# EAGLE design CHEAPO4 (EAGLE 6.3)
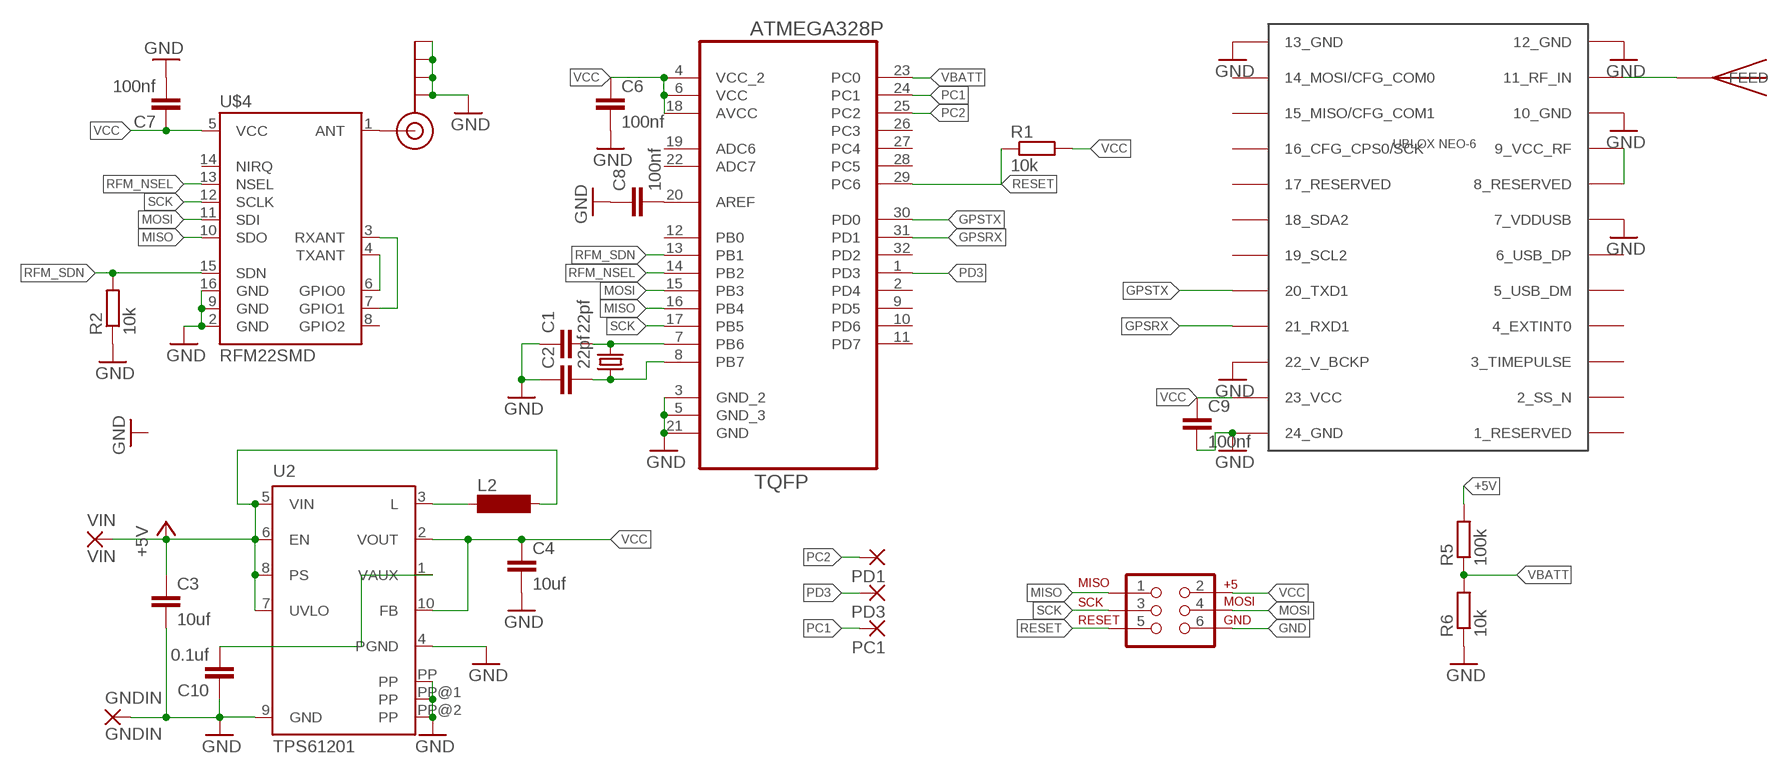
[diagram p0: schematic, sheet 1]

## Parts
C1  22pf  C-EUC0603  [C0603]
C2  22pf  C-EUC0603  [C0603]
C3  10uf  C-EUC1206  [C1206]
C4  10uf  C-EUC1206  [C1206]
C6  100nf  C-EUC0603  [C0603]
C7  100nf  C-EUC0603  [C0603]
C8  100nf  C-EUC0603  [C0603]
C9  100nf  C-EUC0603  [C0603]
C10  0.1uf  C-EUC0603  [C0603]
GNDIN  GNDIN  SMD2  [SMD1,27-2,54]
J1  AVR_SPI_PRG_6PTH  [2X3]
J$1  SMA_EDGE  [SMA-EDGE]
L2  MS50  [MS50]
PC1  SMD2  [SMD1,27-2,54]
PD1  SMD2  [SMD1,27-2,54]
PD3  SMD2  [SMD1,27-2,54]
R1  10k  R-EU_R0603  [R0603]
R2  10k  R-EU_R0603  [R0603]
R5  100k  R-EU_R0603  [R0603]
R6  10k  R-EU_R0603  [R0603]
U1  ATMEGA328P-AU  [QFP80P900X900X120-32N]
U2  TPS61201  [S-PDSO-N10]
U$1  UBLOX_NEO-6  [UBLOX_NEO-6P]
U$2  ABRACON_ABM3_CRYSTALABM03_HC49  [ABM03_HC49]
U$3  JTI_ANTENNA-1575AT43A40  [JTI_ANTENNA-1575AT43A40]
U$4  RFM22SMD  [RFM22-XXX-S2]
VIN  VIN  SMD2  [SMD1,27-2,54]

## Nets
+5V: C3.1 L2.2 R5.2 U2.5(VIN) U2.6(EN) U2.7(UVLO) U2.8(PS) VIN.1(P)
GND: C1.1 C2.1 C3.2 C4.2 C6.2 C7.2 C8.1 C9.2 C10.1 GNDIN.1(P) J1.6 J$1.GND@0(GND) J$1.GND@1(GND) J$1.GND@2(GND) J$1.GND@3(GND) R2.1 R6.1 U1.3(GND_2) U1.5(GND_3) U1.21(GND) U2.4(PGND) U2.9(GND) U2.PP U2.PP@1(PP) U2.PP@2(PP) U$1.7_VDDUSB U$1.10_GND U$1.12_GND U$1.13_GND U$1.22_V_BCKP U$1.24_GND U$4.2(GND) U$4.9(GND) U$4.16(GND)
GPSRX: U1.31(PD1) U$1.21_RXD1
GPSTX: U1.30(PD0) U$1.20_TXD1
MISO: J1.1 U1.16(PB4) U$4.10(SDO)
MOSI: J1.4 U1.15(PB3) U$4.11(SDI)
N$1: C1.2 U1.7(PB6) U$2.2
N$2: C2.2 U1.8(PB7) U$2.1
N$3: U$4.4(TXANT) U$4.6(GPIO0)
N$4: U$4.3(RXANT) U$4.7(GPIO1)
N$5: U$1.8_RESERVED U$1.9_VCC_RF
N$6: U$1.11_RF_IN U$3.FEED
N$7: C8.2 U1.20(AREF)
N$8: J$1.SIG(SIGNAL) U$4.1(ANT)
N$11: L2.1 U2.3(L)
N$13: C10.2 U2.1(VAUX)
PC1: PC1.1(P) U1.24(PC1)
PC2: PD1.1(P) U1.25(PC2)
PD3: PD3.1(P) U1.1(PD3)
RESET: J1.5 R1.1 U1.29(PC6)
RFM_NSEL: U1.14(PB2) U$4.13(NSEL)
RFM_SDN: R2.2 U1.13(PB1) U$4.15(SDN)
SCK: J1.3 U1.17(PB5) U$4.12(SCLK)
VBATT: R5.1 R6.2 U1.23(PC0)
VCC: C4.1 C6.1 C7.1 C9.1 J1.2 R1.2 U1.4(VCC_2) U1.6(VCC) U1.18(AVCC) U2.2(VOUT) U2.10(FB) U$1.23_VCC U$4.5(VCC)
Unconnected: U1.2(PD4) U1.9(PD5) U1.10(PD6) U1.11(PD7) U1.12(PB0) U1.19(ADC6) U1.22(ADC7) U1.26(PC3) U1.27(PC4) U1.28(PC5) U1.32(PD2) U$1.1_RESERVED U$1.2_SS_N U$1.3_TIMEPULSE U$1.4_EXTINT0 U$1.5_USB_DM U$1.6_USB_DP U$1.14_MOSI/CFG_COM0 U$1.15_MISO/CFG_COM1 U$1.16_CFG_CPS0/SCK U$1.17_RESERVED U$1.18_SDA2 U$1.19_SCL2 U$4.8(GPIO2) U$4.14(NIRQ)

## Library data of the parts
C1-C4 C6-C10 = rcl:C-EU: CAPACITOR, European symbol
GNDIN PC1 PD1 PD3 VIN = wirepad:SMD2: SMD PAD
J1 = SparkFun-Connectors:AVR_SPI_PRG_6: AVR ISP 6 Pin This is the reduced ISP connector for AVR programming. Common on Arduino. This footprint will take up less PCB space and can be used with a 10-pin to 6-pin adapter such as SKU: BOB-08508
J$1 = SparkFun-Connectors:SMA_EDGE: SMA Antenna Connector End launch SMA connector. The paste layer has been removed so that the connector can be hand soldered onto the board after reflow.
L2 = inductor-neosid:MS50: INDUCTOR SMD power inductor; OC_FARNELL: unknown; OC_NEWARK: unknown
R1 R2 R5 R6 = rcl:R-EU_: RESISTOR, European symbol
U1 = Ava:ATMEGA328P-AU; DESCRIPTION: 8-bit Microcontroller with In-System Programmable Flash; MPN: ATMEGA328P-AU; OC_FARNELL: 1715486; OC_NEWARK: 14R4631; PACKAGE: TQFP-32; SUPPLIER: Atmel
U2 = texas:TPS6120*: LOW INPUT VOLTAGE SYNCHRONOUS BOOST CONVERTER WITH 1.3-A SWITCHES Source: http://focus.ti.com/lit/ds/symlink/tps61200.pdf; MPN: TPS61200DRCT; OC_FARNELL: 1471238; OC_NEWARK: 37M0066
U$1 = Ava:UBLOX_NEO-6: UBLOX NEO-6 GPS MODULE Author Anthony Stirk / http://ava.upuaut.net http://www.u-blox.com/images/downloads/Product_Docs/LEA-6_NEO-6_MAX-6_HardwareIntegrationManual_%28GPS.G6-HW-09007%29.pdf http://www.u-blox.com/images/downloads/Product_Docs/NEO-6_DataSheet_%28GPS.G6-HW-09005%29.pdf
U$2 = Ava:ABRACON_ABM3_CRYSTAL
U$3 = Ava:JTI_ANTENNA-1575AT43A40
U$4 = SparkFun-RF:RFM22: The RFM22 is a low-power, low cost radio that is capable of operating in the 434MHz and 900MHz open bands. It's frequency is software defined and there are some very good libraries written for it.

## Board
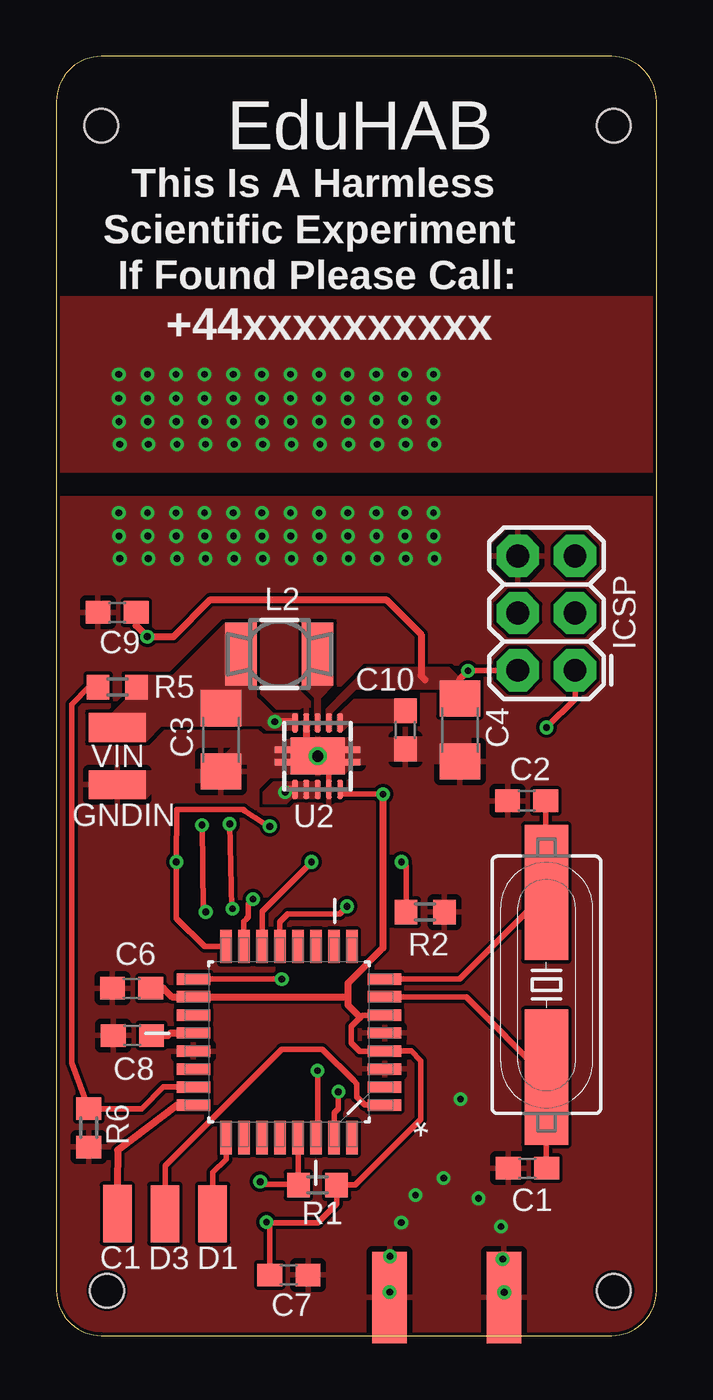
[diagram p1: board, top side]
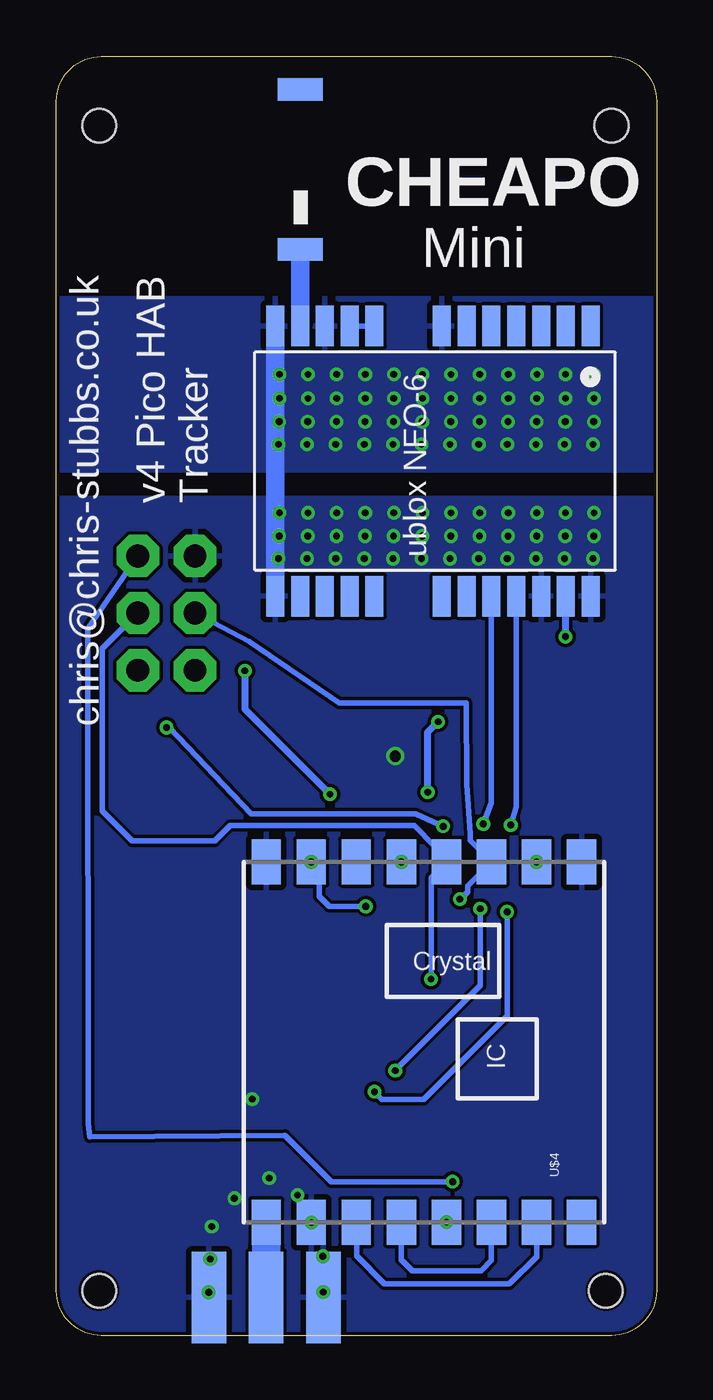
[diagram p2: board, bottom side, seen from below]

Size 26.65 x 56.82 mm. Coordinates in mm from the lower left corner, seen from the top.
Outline: 26.65,2 26.65,54.82 arc90 24.65,56.82 2,56.82 arc90 0,54.82 0,2 arc90 2,0 24.65,0 arc90 26.65,2
Copper layers (1*16): Top 0.035mm / dielectric 1.5mm / Bottom 0.035mm
Design rules "Hackvana": minimum track width 6mil, minimum drill 0.3mm, track to track 6mil, track to pad 6mil, pad to pad 6mil, via to via 6mil, smd to smd 0mil, copper to edge 6mil, drill to drill 6mil, minimum pad ring 10mil, minimum via ring 6mil, stop-mask expansion 2mil, vias tented up to drill 100mil, thermal gap 10mil
Holes 1.5 mm at 2,53.73 24.75,53.73 2.25,2 24.75,2

### Footprints (pad centres in the part's own frame; a part is rotated, then mirrored left to right if it is on the bottom)
C0603 = smd 1.1 x 1: 1 -0.85,0; 2 0.85,0
C1206 = smd 1.6 x 1.8: 1 -1.4,0; 2 1.4,0
SMD1,27-2,54 = smd 1.27 x 2.54: 1 0,0
2X3 = drill 1.016 pad 1.88 octagon: 1 0,0; 2 0,2.54; 3 2.54,0; 4 2.54,2.54; 5 5.08,0; 6 5.08,2.54
SMA-EDGE = smd 1.524 x 4.064: GND@0 0,0; GND@1 5.08,0; SIG 2.54,0 | smd 1.524 x 4.064 bottom: GND@2 0,0; GND@3 5.08,0
MS50 = smd 2.8 x 1.4: 1 0,-1.7; 2 0,1.7
R0603 = smd 1 x 1.1: 1 -0.85,0; 2 0.85,0
QFP80P900X900X120-32N = smd 1.473 x 0.508: 1 -4.242,2.794; 2 -4.242,2.007; 3 -4.242,1.194; 4 -4.242,0.406; 5 -4.242,-0.406; 6 -4.242,-1.194; 7 -4.242,-2.007; 8 -4.242,-2.794; 17 4.242,-2.794; 18 4.242,-2.007; 19 4.242,-1.194; 20 4.242,-0.406; 21 4.242,0.406; 22 4.242,1.194; 23 4.242,2.007; 24 4.242,2.794 | smd 0.508 x 1.473: 9 -2.794,-4.242; 10 -2.007,-4.242; 11 -1.194,-4.242; 12 -0.406,-4.242; 13 0.406,-4.242; 14 1.194,-4.242; 15 2.007,-4.242; 16 2.794,-4.242; 25 2.794,4.242; 26 2.007,4.242; 27 1.194,4.242; 28 0.406,4.242; 29 -0.406,4.242; 30 -1.194,4.242; 31 -2.007,4.242; 32 -2.794,4.242
S-PDSO-N10 = smd 0.28 x 0.85: 1 -1,-1.475; 2 -0.5,-1.475; 3 0,-1.475; 4 0.5,-1.475; 5 1,-1.475; 6 1,1.475; 7 0.5,1.475; 8 0,1.475; 9 -0.5,1.475; 10 -1,1.475 | smd 2.4 x 1.65: PP 0,0 | smd 3.8 x 0.28: PP@1 0,0.275; PP@2 0,-0.275
UBLOX_NEO-6P = smd 1.8 x 0.8: 1_RESERVED 6.4,-7.4; 2_SS_N 6.4,-6.3; 3_TIMEPULSE 6.4,-5.2; 4_EXTINT0 6.4,-4.1; 5_USB_DM 6.4,-3; 6_USB_DP 6.4,-1.9; 7_VDDUSB 6.4,-0.8; 8_RESERVED 6.4,2.2; 9_VCC_RF 6.4,3.3; 10_GND 6.4,4.4; 11_RF_IN 6.4,5.5; 12_GND 6.4,6.6; 13_GND -5.6,6.6; 14_MOSI/CFG_COM0 -5.6,5.5; 15_MISO/CFG_COM1 -5.6,4.4; 16_CFG_CPS0/SCK -5.6,3.3; 17_RESERVED -5.6,2.2; 18_SDA2 -5.6,-0.8; 19_SCL2 -5.6,-1.9; 20_TXD1 -5.6,-3; 21_RXD1 -5.6,-4.1; 22_V_BCKP -5.6,-5.2; 23_VCC -5.6,-6.3; 24_GND -5.6,-7.4
ABM03_HC49 = smd 6 x 1.93: 1 -4.1,0; 2 4.1,0
JTI_ANTENNA-1575AT43A40 = smd 1 x 2: FEED -3.175,0; NC 3.925,0
RFM22-XXX-S2 = smd 2 x 1.3: 1 -8,7; 2 -8,5; 3 -8,3; 4 -8,1; 5 -8,-1; 6 -8,-3; 7 -8,-5; 8 -8,-7; 9 8,-7; 10 8,-5; 11 8,-3; 12 8,-1; 13 8,1; 14 8,3; 15 8,5; 16 8,7

### Placement (x,y rotation side)
C1  20.92,7.43 0 top
C2  20.88,23.75 0 top
C3  7.31,26.46 270 top
C4  17.92,26.9 270 top
C6  3.34,15.42 180 top
C7  10.33,2.69 0 top
C8  3.38,13.33 0 top
C9  2.7,32.12 180 top
C10  15.5,26.9 90 top
GNDIN  2.71,24.47 270 top
J1  23.03,29.55 90 top
J$1  19.87,1.69 0 bottom
L2  9.9,30.27 90 top
PC1  2.71,5.42 0 top
PD1  6.94,5.42 0 top
PD3  4.82,5.41 0 top
R1  11.6,6.69 0 top
R2  16.38,18.81 180 top
R5  2.71,28.8 0 top
R6  1.44,9.23 90 top
U1  10.33,13.04 180 top
U2  11.6,25.74 180 top
U$1  10.33,38.44 90 bottom
U$2  21.76,15.58 270 top
U$3  15.83,51.42 90 bottom
U$4  10.33,13.04 90 bottom
VIN  2.71,27.01 270 top

### Tracks (layer width: path | path; a pad name or v marks a point on that pad's centre or on a via)
+5V  (via drill 0.3)
  Top 0.254: 10.59,27.2 U2.5
  Top 0.305: U2.6 10.29,24.27 v10.16,24.13 | v9.7,27.27 10.54,27.27 U2.5
  Bottom 0.305: v10.16,24.13 10.16,26.81 v9.7,27.27
  pour Top (no thermals): 1.44,27.65 2.46,27.65 3.06,28.24 3.06,29.34 3.06,29.35 4.06,29.35 4.06,29.35 5.18,29.35 7.5,31.67 8.91,31.67 8.91,31.67 8.91,28.37 9.11,28.17 9.63,27.65 10.74,27.65 10.74,27.64 10.74,26.88 10.74,26.87 10.46,26.87 9.31,26.87 9.12,27.06 8.12,27.06 8.12,27.06 4.67,27.06 3.98,26.38 1.45,26.38 1.44,26.37 1.44,27.64 1.44,27.64
  pour Top (no thermals): 11.74,24.62 9.63,24.62 9.17,24.15 9.17,23.6 9.89,23.6 10.22,23.6 10.45,23.83 11.75,23.83 11.75,24.62
GND  (via drill 0.3, 0.5)
  Top 0.254: U2.4 | U2.9 12.09,25.13 U2.PP@1
  Top 0.305: U2.4 11.1,26.52 U2.PP@2
  Bottom 0.813: U$1.12_GND U$1.13_GND
  other vias: 14.8,1.94 19.89,1.93 17.95,10.5 15.32,5.02 2.77,42.7 2.77,41.62 2.78,40.59 2.82,39.59 4.04,42.7 4.04,41.62 4.05,40.59 4.09,39.59 5.31,42.7 5.31,41.62 5.32,40.59 5.36,39.59 6.58,42.7 6.58,41.62 6.59,40.59 6.63,39.59 7.85,42.7 7.85,41.62 7.86,40.59 7.9,39.59 9.12,42.7 9.12,41.62 9.13,40.59 9.17,39.59 10.39,42.7 10.39,41.62 10.4,40.59 10.44,39.59 11.66,42.7 11.66,41.62 11.67,40.59 11.71,39.59 12.93,42.7 12.93,41.62 12.94,40.59 12.98,39.59 14.2,42.7 14.2,41.62 14.21,40.59 14.25,39.59 15.47,42.7 15.47,41.62 15.48,40.59 15.52,39.59 16.74,42.7 16.74,41.62 16.75,40.59 16.79,39.59 2.77,36.54 2.78,35.51 2.82,34.51 4.04,36.54 4.05,35.51 4.09,34.51 5.31,36.54 5.32,35.51 5.36,34.51 6.58,36.54 6.59,35.51 6.63,34.51 7.85,36.54 7.86,35.51 7.9,34.51 9.12,36.54 9.13,35.51 9.17,34.51 10.39,36.54 10.4,35.51 10.44,34.51 11.66,36.54 11.67,35.51 11.71,34.51 12.93,36.54 12.94,35.51 12.98,34.51 14.2,36.54 14.21,35.51 14.25,34.51 15.47,36.54 15.48,35.51 15.52,34.51 16.74,36.54 16.75,35.51 16.79,34.51 19.82,3.41 19.75,4.85 18.75,6.1 17.2,7 15.95,6.25 14.82,3.52 11.61,25.74
  pour Top (rank 2): 0.17,37.17 0.17,2.07 arc90 2.17,0.07 24.57,0.07 arc90 26.57,2.07 26.57,37.17
  pour Bottom: 0.17,37.17 26.57,37.17 26.57,2.07 arc-90 24.57,0.07 2.17,0.07 arc-90 0.17,2.07
  pour Top: 0.17,38.44 26.57,38.44 26.57,46.06 0.17,46.06
  pour Bottom: 0.17,38.44 26.57,38.44 26.57,46.06 0.17,46.06
  pour Top (no thermals): 3.98,25.11 3.99,25.1 6.75,25.1 8.12,26.47 9.12,26.47 10.3,26.47 10.4,26.57 14.96,26.57 15,26.6 18.41,26.6 18.42,26.6 18.42,25.5 18.41,25.5 13.38,25.5 12.8,24.91 10.4,24.91 10.4,24.91 9.57,24.91 9.12,25.37 8.12,25.37 8.12,25.37 8.1,25.37 7.27,24.54 4.71,24.54 3.99,23.82 1.45,23.82 1.44,23.84 1.44,25.11 1.52,25.1
GPSRX  (via drill 0.3)
  Top 0.254: v6.47,22.68 6.52,18.93 v6.63,18.82 | v12.52,10.83 12.52,10.07 12.34,9.89 U1.31
  Bottom 0.254: U$1.21_RXD1 6.23,23.49 v6.47,22.68 | v6.63,18.82 6.63,14.2 10.33,10.5 12.19,10.5 v12.52,10.83
GPSTX  (via drill 0.3)
  Top 0.254: v7.7,22.72 7.79,19 v7.83,18.96 | v11.6,11.77 11.6,8.87 U1.30
  Bottom 0.254: U$1.20_TXD1 7.33,23.66 v7.7,22.72 | v7.83,18.96 7.83,15.54 v11.6,11.77
MISO  (via drill 0.3)
  Top 0.254: U1.16 6.59,17.28 5.34,18.54 U$4.10 5.34,23.36 7.36,23.37 7.64,23.37 7.92,23.37 8.29,23.38 8.37,23.31 9.26,22.72 v9.48,22.62 | J1.1 23.03,28.28 v21.76,27.01
  Bottom 0.254: v21.76,27.01 21.63,27.01 17.99,23.18 10.7,23.17 v9.48,22.62 | U$4.10 5.33,20.74 5.25,20.66 5.25,20.96 U$4.10
  other vias: 5.33,21.04
MOSI  (via drill 0.3)
  Top 0.254: U1.15 8.32,18.39 8.45,18.51 8.45,18.52 8.51,18.59 8.51,19.17 v8.73,19.39
  Bottom 0.254: v8.73,19.39 8.7,19.39 8.39,19.7 8.39,19.98 U$4.11 8.28,21.99 8.28,22.28 8.42,24.5 8.46,28.09 14.09,28.1 18.09,30.82 J1.4
N$1
  Top 0.254: U1.7 18.19,15.05 U$2.2 C1.2
N$2
  Top 0.254: U1.8 17.91,15.83 U$2.1 C2.2
N$3
  Bottom 0.254: U$4.6 7.33,3.34 7.79,2.88 10.85,2.88 11.33,3.37 U$4.4
N$4
  Bottom 0.254: U$4.7 5.33,3.51 6.54,2.3 12.08,2.3 13.32,3.54 U$4.3
N$5
  Bottom 0.254: U$1.8_RESERVED U$1.9_VCC_RF
N$6
  Bottom 0.254: U$1.11_RF_IN
  Bottom 0.813: U$3.FEED U$1.11_RF_IN
N$7
  Top 0.305: C8.2 4.96,13.33 5.07,13.44 U1.20
N$8
  Bottom 1.27: U$4.1 J$1.SIG
N$11
  pour Top (no thermals): 11.46,26.88 11.46,28.32 10.91,28.87 10.91,31.67 12.31,31.67 12.31,28.87 12.31,28.87 11.74,28.3 11.74,26.86 11.73,26.87 11.46,26.87
N$13
  pour Top (no thermals): 12.53,27.64 13.21,28.27 16,28.3 16,27.2 13.1,27.2 12.74,26.84 12.46,26.84 12.46,27.57 12.46,27.57
PC1
  Top 0.305: U1.24 5.39,10.25 2.72,8.23 2.71,6.69 PC1.1
PC2
  Top 0.254: U1.25 7.54,7.84 6.94,7.24 PD1.1 | PD1.1
PD3
  Top 0.254: U1.1 13.7,10.25 13.34,10.61 13.34,11.19 13.2,11.33 11.8,12.72 10.02,12.72 4.83,7.53 4.83,5.42 PD3.1
RESET  (via drill 0.3)
  Top 0.254: R1.1 10.74,6.7 U1.29 10.74,6.76 10.77,6.72 9.16,6.72 v9.05,6.83
  Bottom 0.254: v9.05,6.83 14.45,6.83 16.51,8.89 25.18,8.83 25.24,9.43 25.26,31.39 J1.5
RFM_NSEL  (via drill 0.3)
  Top 0.254: U1.14 9.14,18.85 U$4.13
  Bottom 0.254: U$4.13 11.33,20.93 11.6,20.66 11.6,20.77 U$4.13
  other vias: 11.33,21.04
RFM_SDN  (via drill 0.3)
  Top 0.254: R2.2 15.53,20.84 U$4.15 | U1.13 9.92,18.38 10.27,18.73 12.57,18.73 v12.91,19.07
  Bottom 0.254: U$4.15 15.33,20.74 15.41,20.66 15.41,20.96 U$4.15 | v12.91,19.07 14.53,19.07 14.97,19.51 14.97,20.68 U$4.15
  other vias: 15.33,21.04
SCK  (via drill 0.3)
  Top 0.254: U1.17 v10,15.83 v10.01,15.83
  Bottom 0.254: v10.01,15.83 10.01,20.36 U$4.12 9.84,21.55 9.84,21.74 10.76,22.65 18.94,22.65 19.61,21.98 23.27,21.98 24.6,23.31 24.6,30.52 J1.3
VBATT
  Top 0.254: R5.1 1.45,28.8 0.68,28.03 0.68,12.11 R6.2 3.79,10.08 4.75,11.04 U1.23
VCC  (via drill 0.3)
  Top 0.254: C7.1 9.48,4.89 U$4.5 9.35,5.02 11.61,5.02 12.45,5.86 R1.2 13.28,6.69 16.19,9.6 16.19,12.2 15.75,12.64 U1.4 13.48,12.62 13.1,13 13.1,13.74 13.49,14.13 13.6,14.23 U1.6 | C4.1 18.02,28.04 | v14.5,24.05 12.6,24.05 U2.10 | J1.2 18.28,29.55 v18.28,29.52
  Top 0.305: C6.1 4.75,15.42 5.13,15.04 U1.18 | U1.18 | C9.1 3.55,31.54 v4.04,31.05 5.2,31.05 6.84,32.69 14.64,32.69 16.2,31.13 16.2,29.3 16.38,29.12 | C4.1 17.91,29.16 v18.28,29.52 | v14.5,24.05 14.5,17.21 12.94,15.65 12.94,15.04 | 12.94,15.04 12.94,14.68 13.49,14.13 | U1.18 12.94,15.04
  Bottom 0.254: U$4.5 9.33,4.42 9.06,4.15 9.06,4.77 U$4.5
  Bottom 0.305: v4.04,31.05 U$1.23_VCC | v18.28,29.52 18.28,27.82 v14.5,24.05
  other vias: 9.33,5.04
  pour Top (no thermals): 12.24,26.86 12.24,27.66 13.32,28.69 17.02,28.69 17.41,28.3 17.41,27.52 18.43,27.53 18.42,28.72 17.44,29.7 13.78,29.7 11.96,27.84 11.96,26.86 12.24,26.86

### Text on the board
tPlace: EduHAB | This Is A Harmless | Scientific Experiment | If Found Please Call: | +44xxxxxxxxxx | ICSP | C1 | D3 | D1
bPlace: CHEAPO | Mini | v4 Pico HAB / Tracker | chris@chris-stubbs.co.uk